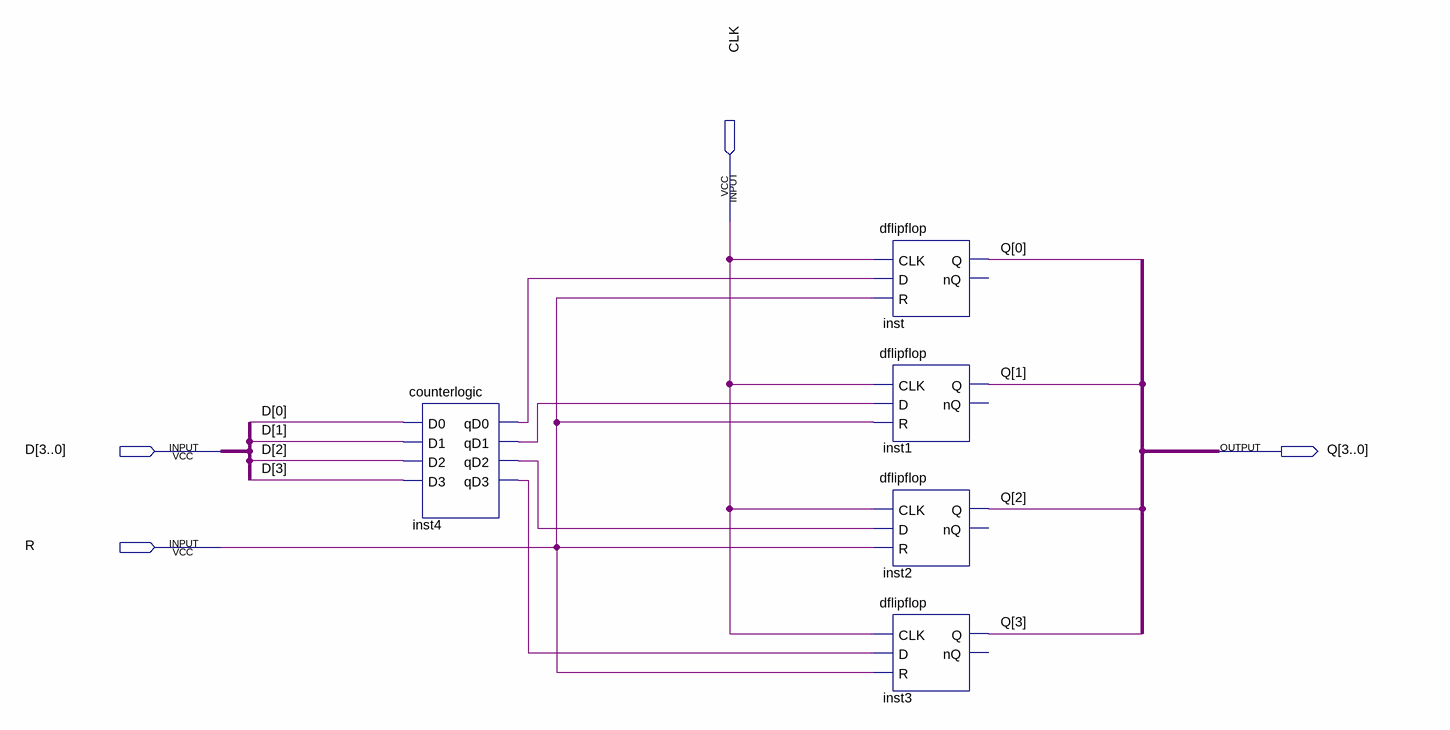
[diagram p0: schematic sheet]
// Quartus schematic fourbitddflipflop.bdf as structural Verilog: 5 symbols, 4 pins
module fourbitddflipflop (
  input  CLK,
  input  [3:0] D,
  input  R,
  output [3:0] Q
);

  wire inst4_qd0, inst4_qd1, inst4_qd2, inst4_qd3;

  counterlogic inst4 (
    .D0(D[0]), .D1(D[1]), .D2(D[2]), .D3(D[3]), .qD0(inst4_qd0), .qD1(inst4_qd1), .qD2(inst4_qd2),
    .qD3(inst4_qd3));
  dflipflop inst (.CLK(CLK), .D(inst4_qd0), .R(R), .Q(Q[0]));  // open: nQ
  dflipflop inst1 (.CLK(CLK), .D(inst4_qd1), .R(R), .Q(Q[1]));  // open: nQ
  dflipflop inst2 (.CLK(CLK), .D(inst4_qd2), .R(R), .Q(Q[2]));  // open: nQ
  dflipflop inst3 (.CLK(CLK), .D(inst4_qd3), .R(R), .Q(Q[3]));  // open: nQ
endmodule
